# EAGLE design Adafruit ALS-PT19-315C Breakout (EAGLE 6.4)
COMPANY: ADAFRUIT INDUSTRIES; DRAWN: KTOWN; REV: A
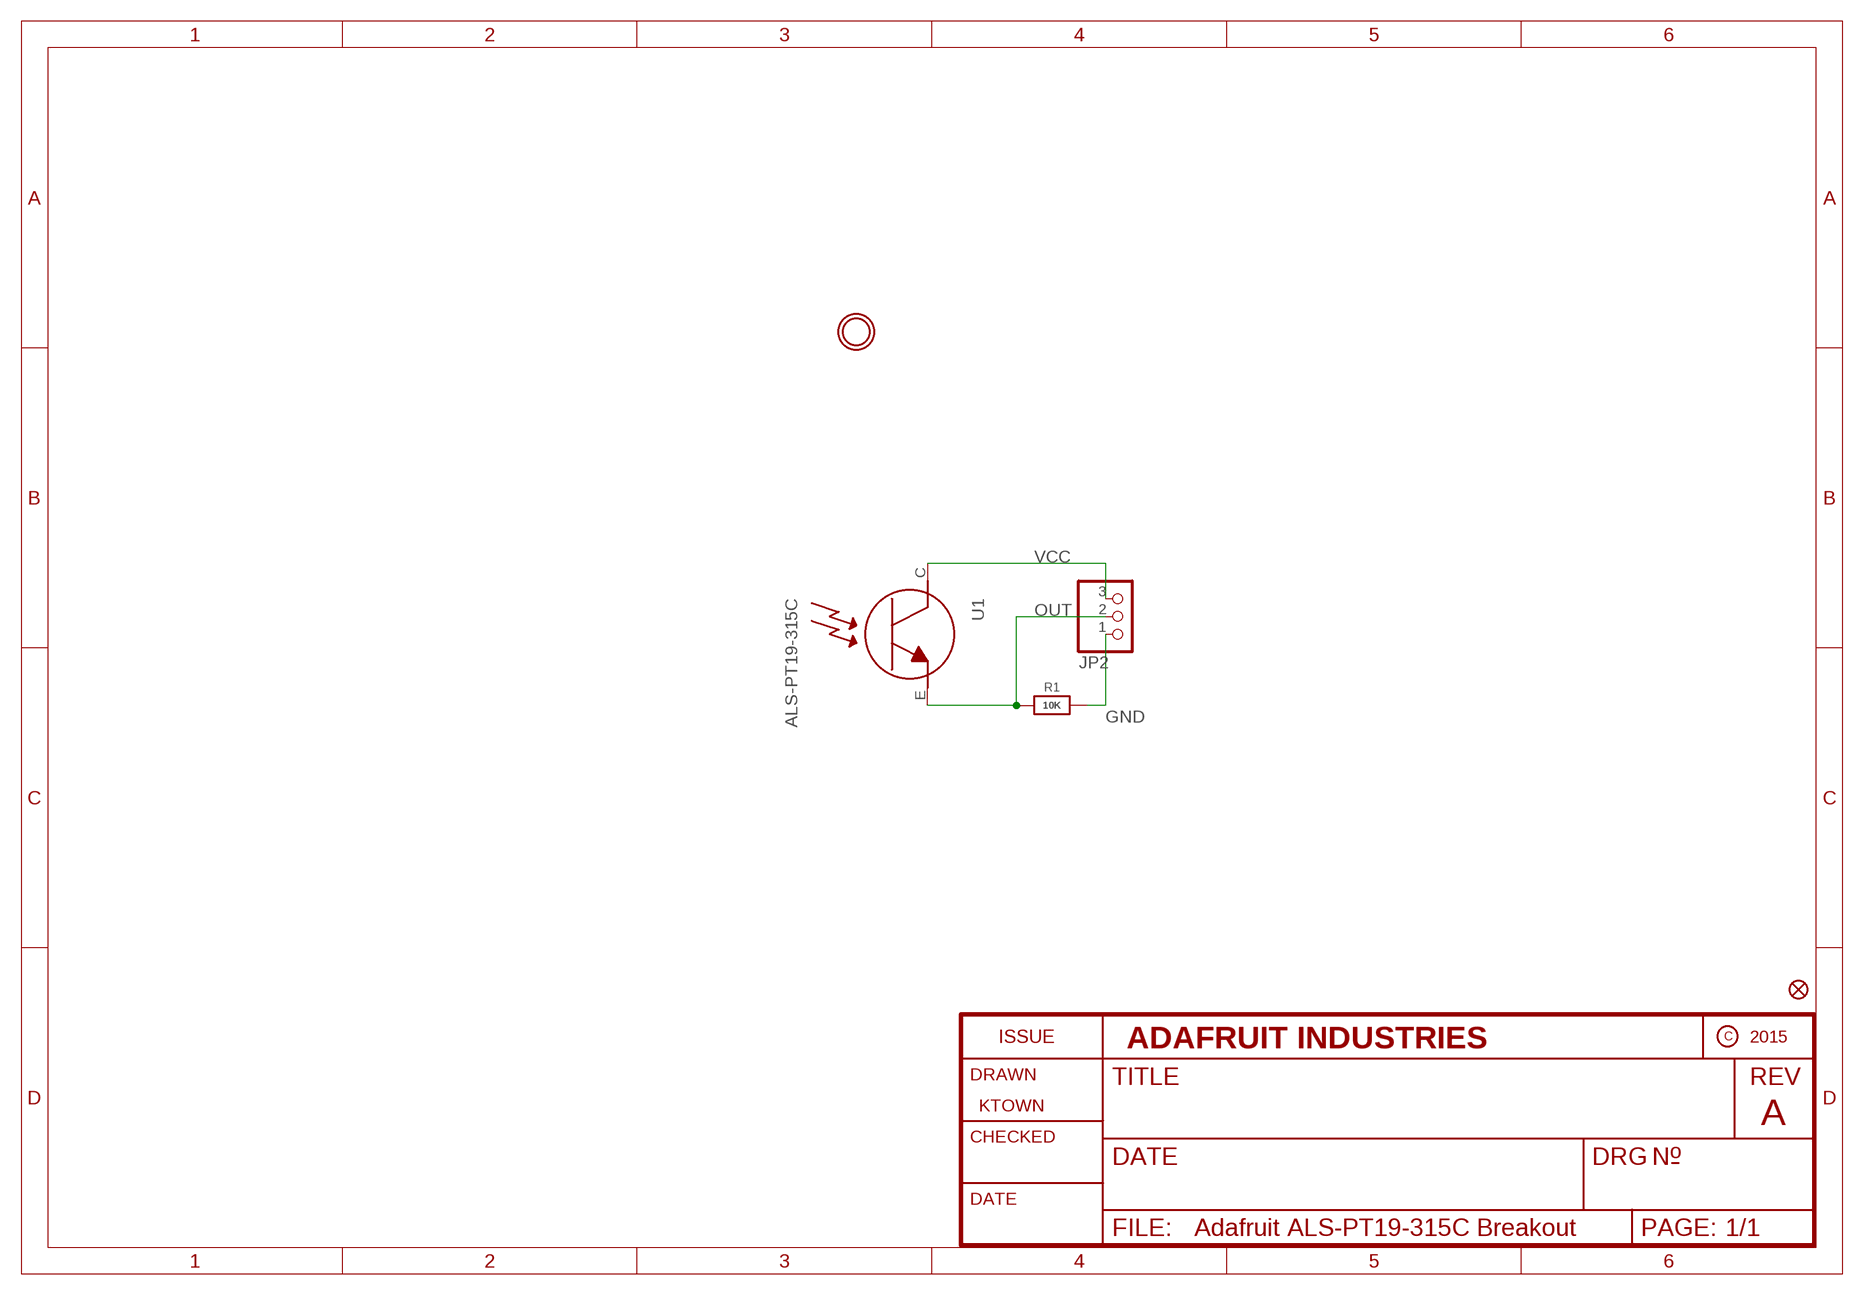
[diagram p0: schematic, sheet 1]

## Parts
FID1  FIDUCIAL""  [FIDUCIAL_1MM]
JP2  HEADER-1X3ROUND  [1X03_ROUND]
R1  10K  RESISTOR_0603_NOOUT  [0603-NO]
U1  ALS-PT19-315C  LIGHT_ALS-PT19-315C  [ALS-PT19-315C]
U$2  MOUNTINGHOLE2.0  [MOUNTINGHOLE_2.0_PLATED]

## Nets
GND: JP2.1 R1.1
OUT: JP2.2 R1.2 U1.E
VCC: JP2.3 U1.C

## Library data of the parts
FID1 = microbuilder:FIDUCIAL: Fiducial Alignment Points Various fiducial points for machine vision alignment.; BOM: EXCLUDE
JP2 = microbuilder:HEADER-1X3: PIN HEADER
R1 = microbuilder:RESISTOR: Resistors For new designs, use the packages preceded by an '_' character since they are more reliable: The following footprints should be used on most boards: _0402 - Standard footprint for regular board layouts _0603 - Standard footprint for regular board layouts _0805 - Standard footprint for regular board layouts _1206 - Standard footprint for regular board layouts For extremely tight-pitch boards where space is at a premium, the following 'micro-pitch' footprints can be used (smaller pads, no silkscreen outline, etc.): _0402MP - Micro-pitch footprint for very dense/compact boards _0603MP - Micro-pitch footprint for very dense/compact boards _0805MP - Micro-pitch footprint for very dense/compact boards _1206MP - Micro-pitch footprint for very dense/compact boards
U1 = microbuilder:LIGHT_ALS-PT19-315C: ALS-PT19-315C - Analog Light Sensor VCC: 2.5-5.5V
U$2 = microbuilder:MOUNTINGHOLE: Mounting Hole For #2 screws (0.086"/2.18mm width, 0.094"/2.4mm hole) use 2.5mm; BOM: EXCLUDE

## Board
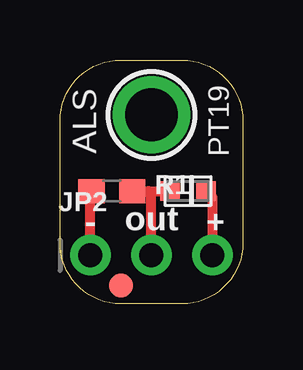
[diagram p1: board, top side]
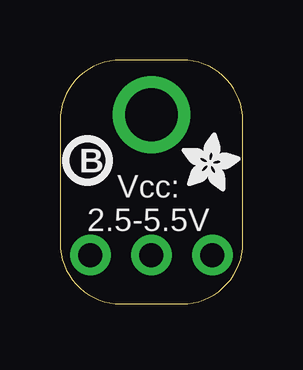
[diagram p2: board, bottom side, seen from below]

Size 7.62 x 10.16 mm. Coordinates in mm from the lower left corner, seen from the top.
Outline: 7.62,7.62 7.62,2.54 arc-90 5.08,0 2.54,0 arc-90 0,2.54 0,7.62 arc-90 2.54,10.16 5.08,10.16 arc-90 7.62,7.62
Copper layers (1*16): Top 0.035mm / dielectric 1.5mm / Bottom 0.035mm
Design rules "adafruit": minimum track width 8mil, minimum drill 15.5mil, track to track 8mil, track to pad 8mil, pad to pad 8mil, via to via 8mil, smd to smd 8mil, copper to edge 10mil, drill to drill 8mil, minimum pad ring 10mil, minimum via ring 8mil, stop-mask expansion 2mil, vias tented up to drill 20mil, thermal gap 10mil

### Footprints (pad centres in the part's own frame; a part is rotated, then mirrored left to right if it is on the bottom)
FIDUCIAL_1MM = smd 1 x 1: 1 0,0
1X03_ROUND = drill 1 pad 1.676: 1 -2.54,0; 2 0,0; 3 2.54,0
0603-NO = smd 1.1 x 1: 1 -0.85,0; 2 0.85,0
ALS-PT19-315C = smd 0.8 x 0.8: C -0.75,0; E 0.75,0
MOUNTINGHOLE_2.0_PLATED = drill 2.2 pad 3: P$1 0,0

### Placement (x,y rotation side)
FID1  2.54,0.76 0 top
JP2  3.81,2.03 0 top
R1  2.16,4.7 0 top
U1  5.33,4.7 180 top
U$1  [ADAFRUIT_2.5MM]  2.54,4.7 0 bottom
U$2  3.81,7.87 0 top
U$3  [PCBFEAT-REV-040]  6.48,5.97 0 bottom

### Tracks (layer width: path | path; a pad name or v marks a point on that pad's centre or on a via)
GND
  Top 0.406: JP2.1 1.27,4.66 R1.1
OUT
  Top 0.406: R1.2 3.68,4.7 | 3.68,4.7 U1.E | JP2.2 3.81,4.57 3.68,4.7
VCC
  Top 0.406: U1.C 6.35,4.43 JP2.3

### Text on the board
tPlace: ALS | PT19 | out | - | +
bPlace: Vcc: / 2.5-5.5V